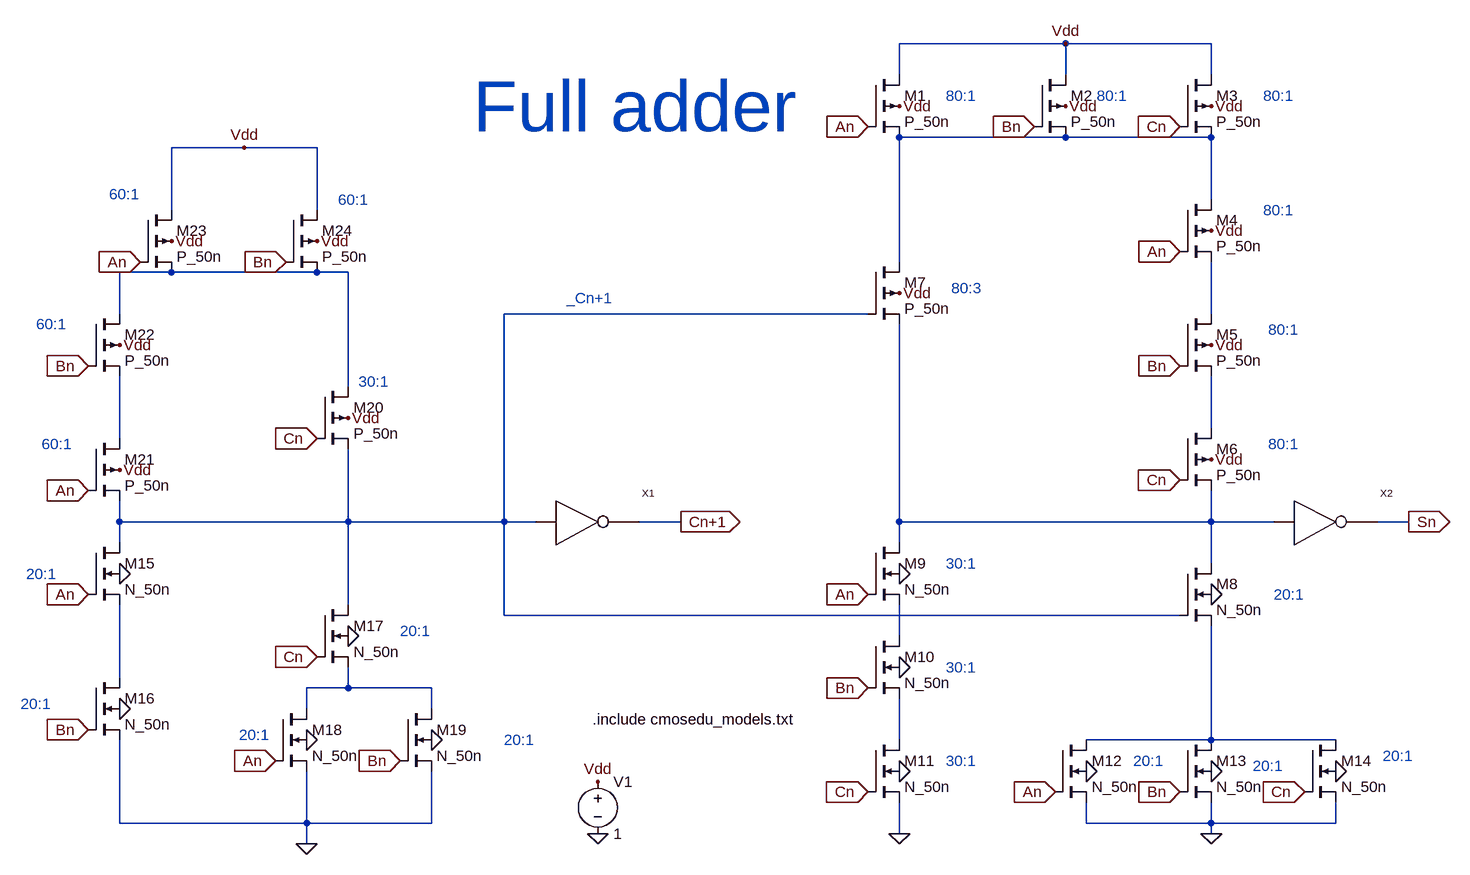
[diagram p0: schematic FullAdder.asc]
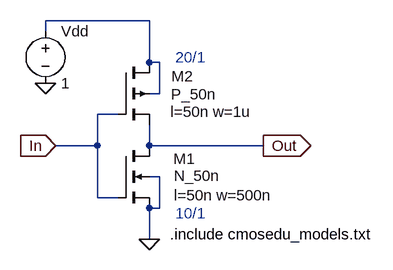
[diagram p1: sub-circuit inverter.asc]
FullAdder.asc, the LTspice schematic file:
Version 4
SHEET 1 1356 1268
WIRE 368 16 112 16
WIRE 592 16 368 16
WIRE 112 64 112 16
WIRE 368 64 368 16
WIRE 592 64 592 16
WIRE 368 160 112 160
WIRE 592 160 368 160
WIRE -896 176 -1008 176
WIRE -784 176 -896 176
WIRE 592 256 592 160
WIRE -1008 272 -1008 176
WIRE -784 272 -784 176
WIRE 112 352 112 160
WIRE -1008 368 -1088 368
WIRE -784 368 -1008 368
WIRE -736 368 -784 368
WIRE -1088 432 -1088 368
WIRE 64 432 -496 432
WIRE 592 432 592 352
WIRE -736 544 -736 368
WIRE 592 608 592 528
WIRE -1088 624 -1088 528
WIRE -1088 752 -1088 720
WIRE -736 752 -736 640
WIRE -736 752 -1088 752
WIRE -496 752 -496 432
WIRE -496 752 -736 752
WIRE -448 752 -496 752
WIRE -224 752 -288 752
WIRE 112 752 112 448
WIRE 592 752 592 704
WIRE 592 752 112 752
WIRE 688 752 592 752
WIRE 896 752 848 752
WIRE -1088 784 -1088 752
WIRE 112 784 112 752
WIRE 592 816 592 752
WIRE -736 880 -736 752
WIRE -496 896 -496 752
WIRE 544 896 -496 896
WIRE 112 928 112 880
WIRE -1088 992 -1088 880
WIRE -736 1008 -736 976
WIRE -736 1008 -800 1008
WIRE -608 1008 -736 1008
WIRE -800 1040 -800 1008
WIRE -608 1040 -608 1008
WIRE 112 1088 112 1024
WIRE 592 1088 592 912
WIRE 592 1088 400 1088
WIRE 784 1088 592 1088
WIRE -1088 1216 -1088 1088
WIRE -800 1216 -800 1136
WIRE -800 1216 -1088 1216
WIRE -608 1216 -608 1136
WIRE -608 1216 -800 1216
WIRE 400 1216 400 1184
WIRE 592 1216 592 1184
WIRE 592 1216 400 1216
WIRE 784 1216 784 1184
WIRE 784 1216 592 1216
WIRE 112 1232 112 1184
WIRE 592 1232 592 1216
WIRE -800 1248 -800 1216
FLAG 592 1232 0
FLAG 112 1232 0
FLAG -800 1248 0
FLAG -1056 352 An
IOPIN -1056 352 In
FLAG -1136 704 An
IOPIN -1136 704 In
FLAG -1136 864 An
IOPIN -1136 864 In
FLAG -848 1120 An
IOPIN -848 1120 In
FLAG 64 144 An
IOPIN 64 144 In
FLAG 544 336 An
IOPIN 544 336 In
FLAG 64 864 An
IOPIN 64 864 In
FLAG 352 1168 An
IOPIN 352 1168 In
FLAG -832 352 Bn
IOPIN -832 352 In
FLAG -1136 512 Bn
IOPIN -1136 512 In
FLAG -1136 1072 Bn
IOPIN -1136 1072 In
FLAG -656 1120 Bn
IOPIN -656 1120 In
FLAG 320 144 Bn
IOPIN 320 144 In
FLAG 544 512 Bn
IOPIN 544 512 In
FLAG 544 1168 Bn
IOPIN 544 1168 In
FLAG 64 1008 Bn
IOPIN 64 1008 In
FLAG -784 624 Cn
IOPIN -784 624 In
FLAG -784 960 Cn
IOPIN -784 960 In
FLAG 736 1168 Cn
IOPIN 736 1168 In
FLAG 64 1168 Cn
IOPIN 64 1168 In
FLAG 544 688 Cn
IOPIN 544 688 In
FLAG -224 752 Cn+1
IOPIN -224 752 Out
FLAG -352 1232 0
FLAG -352 1152 Vdd
FLAG 368 16 Vdd
FLAG -896 176 Vdd
FLAG 896 752 Sn
IOPIN 896 752 Out
FLAG -800 1088 0
FLAG -608 1088 0
FLAG -1088 1040 0
FLAG -736 928 0
FLAG -1088 832 0
FLAG 112 832 0
FLAG 112 976 0
FLAG 112 1136 0
FLAG 400 1136 0
FLAG 592 1136 0
FLAG 784 1136 0
FLAG 592 864 0
FLAG -1008 320 Vdd
FLAG -784 320 Vdd
FLAG -1088 480 Vdd
FLAG -736 592 Vdd
FLAG -1088 672 Vdd
FLAG 592 656 Vdd
FLAG 592 480 Vdd
FLAG 592 304 Vdd
FLAG 592 112 Vdd
FLAG 368 112 Vdd
FLAG 112 112 Vdd
FLAG 112 400 Vdd
FLAG 544 144 Cn
IOPIN 544 144 In
SYMBOL pmos4 64 64 R0
SYMATTR InstName M1
SYMATTR Value P_50n
SYMATTR Value2 l=50n w=4000n
SYMBOL pmos4 320 64 R0
SYMATTR InstName M2
SYMATTR Value P_50n
SYMATTR Value2 l=50n w=4000n
SYMBOL pmos4 544 64 R0
SYMATTR InstName M3
SYMATTR Value P_50n
SYMATTR Value2 l=50n w=4000n
SYMBOL pmos4 544 256 R0
SYMATTR InstName M4
SYMATTR Value P_50n
SYMATTR Value2 l=50n w=4000n
SYMBOL pmos4 544 432 R0
SYMATTR InstName M5
SYMATTR Value P_50n
SYMATTR Value2 l=50n w=4000n
SYMBOL pmos4 544 608 R0
SYMATTR InstName M6
SYMATTR Value P_50n
SYMATTR Value2 l=50n w=4000n
SYMBOL pmos4 64 352 R0
SYMATTR InstName M7
SYMATTR Value P_50n
SYMATTR Value2 l=50n w=1333.333n
SYMBOL nmos4 544 816 R0
SYMATTR InstName M8
SYMATTR Value N_50n
SYMATTR Value2 l=50n w=1000n
SYMBOL nmos4 64 784 R0
SYMATTR InstName M9
SYMATTR Value N_50n
SYMATTR Value2 l=50n w=1500n
SYMBOL nmos4 64 928 R0
SYMATTR InstName M10
SYMATTR Value N_50n
SYMATTR Value2 l=50n w=1500n
SYMBOL nmos4 64 1088 R0
SYMATTR InstName M11
SYMATTR Value N_50n
SYMATTR Value2 l=50n w=1500n
SYMBOL nmos4 352 1088 R0
SYMATTR InstName M12
SYMATTR Value N_50n
SYMATTR Value2 l=50n w=1000n
SYMBOL nmos4 544 1088 R0
SYMATTR InstName M13
SYMATTR Value N_50n
SYMATTR Value2 l=50n w=1000n
SYMBOL nmos4 736 1088 R0
SYMATTR InstName M14
SYMATTR Value N_50n
SYMATTR Value2 l=50n w=1000n
SYMBOL nmos4 -1136 784 R0
SYMATTR InstName M15
SYMATTR Value N_50n
SYMATTR Value2 l=50n w=1000n
SYMBOL nmos4 -1136 992 R0
SYMATTR InstName M16
SYMATTR Value N_50n
SYMATTR Value2 l=50n w=1000n
SYMBOL nmos4 -784 880 R0
SYMATTR InstName M17
SYMATTR Value N_50n
SYMATTR Value2 l=50n w=1000n
SYMBOL nmos4 -848 1040 R0
SYMATTR InstName M18
SYMATTR Value N_50n
SYMATTR Value2 l=50n w=1000n
SYMBOL nmos4 -656 1040 R0
SYMATTR InstName M19
SYMATTR Value N_50n
SYMATTR Value2 l=50n w=1000n
SYMBOL pmos4 -784 544 R0
SYMATTR InstName M20
SYMATTR Value P_50n
SYMATTR Value2 l=50n w=1500n
SYMBOL pmos4 -1136 624 R0
SYMATTR InstName M21
SYMATTR Value P_50n
SYMATTR Value2 l=50n w=3000n
SYMBOL pmos4 -1136 432 R0
SYMATTR InstName M22
SYMATTR Value P_50n
SYMATTR Value2 l=50n w=3000n
SYMBOL pmos4 -1056 272 R0
SYMATTR InstName M23
SYMATTR Value P_50n
SYMATTR Value2 l=50n w=3000n
SYMBOL pmos4 -832 272 R0
SYMATTR InstName M24
SYMATTR Value P_50n
SYMATTR Value2 l=50n w=3000n
SYMBOL voltage -352 1136 R0
SYMATTR InstName V1
SYMATTR Value 1
SYMBOL Inverter -416 688 R0
SYMATTR InstName X1
SYMBOL Inverter 720 688 R0
SYMATTR InstName X2
TEXT -360 1056 Left 2 !.include cmosedu_models.txt
TEXT -400 408 Left 2 ;_Cn+1
TEXT -752 256 Left 2 ;60:1
TEXT -1104 248 Left 2 ;60:1
TEXT -1216 448 Left 2 ;60:1
TEXT -1208 632 Left 2 ;60:1
TEXT -720 536 Left 2 ;30:1
TEXT -1232 832 Left 2 ;20:1
TEXT -1240 1032 Left 2 ;20:1
TEXT -656 920 Left 2 ;20:1
TEXT -496 1088 Left 2 ;20:1
TEXT -904 1080 Left 2 ;20:1
TEXT 688 864 Left 2 ;20:1
TEXT 856 1112 Left 2 ;20:1
TEXT 656 1128 Left 2 ;20:1
TEXT 472 1120 Left 2 ;20:1
TEXT 184 816 Left 2 ;30:1
TEXT 184 976 Left 2 ;30:1
TEXT 184 1120 Left 2 ;30:1
TEXT 192 392 Left 2 ;80:3
TEXT 680 632 Left 2 ;80:1
TEXT 680 456 Left 2 ;80:1
TEXT 672 272 Left 2 ;80:1
TEXT 672 96 Left 2 ;80:1
TEXT 416 96 Left 2 ;80:1
TEXT 184 96 Left 2 ;80:1
TEXT -544 112 Left 7 ;Full adder

inverter.asc, the sub-circuit schematic file:
Version 4
SHEET 1 1136 680
WIRE 448 -368 288 -368
WIRE 288 -352 288 -368
WIRE 448 -304 448 -368
WIRE 464 -304 448 -304
WIRE 464 -256 464 -304
WIRE 464 -256 448 -256
WIRE 400 -224 368 -224
WIRE 368 -176 368 -224
WIRE 368 -176 304 -176
WIRE 448 -176 448 -208
WIRE 624 -176 448 -176
WIRE 464 -128 448 -128
WIRE 368 -96 368 -176
WIRE 400 -96 368 -96
WIRE 464 -80 464 -128
WIRE 464 -80 448 -80
WIRE 448 -32 448 -80
FLAG 304 -176 In
IOPIN 304 -176 In
FLAG 624 -176 Out
IOPIN 624 -176 Out
FLAG 448 -32 0
FLAG 288 -272 0
SYMBOL nmos4 400 -176 R0
WINDOW 0 119 20 Right 2
WINDOW 3 157 46 Right 2
WINDOW 123 238 76 Right 2
SYMATTR InstName M1
SYMATTR Value N_50n
SYMATTR Value2 l=50n w=500n
SYMBOL pmos4 400 -304 R0
WINDOW 0 116 21 Right 2
WINDOW 3 151 49 Right 2
WINDOW 123 206 76 Right 2
SYMATTR InstName M2
SYMATTR Value P_50n
SYMATTR Value2 l=50n w=1u
SYMBOL voltage 288 -368 R0
SYMATTR InstName Vdd
SYMATTR Value 1
TEXT 488 -312 Left 2 ;20/1
TEXT 488 -72 Left 2 ;10/1
TEXT 480 -40 Left 2 !.include cmosedu_models.txt

The netlist it stands for:
* FullAdder.asc
M1 Vdd An N001 Vdd P_50n l=50n w=4000n
M2 Vdd Bn N001 Vdd P_50n l=50n w=4000n
M3 Vdd Cn N001 Vdd P_50n l=50n w=4000n
M4 N001 An N004 Vdd P_50n l=50n w=4000n
M5 N004 Bn N005 Vdd P_50n l=50n w=4000n
M6 N005 Cn N007 Vdd P_50n l=50n w=4000n
M7 N001 N003 N007 Vdd P_50n l=50n w=1333.333n
M8 N007 N003 N012 0 N_50n l=50n w=1000n
M9 N007 An N008 0 N_50n l=50n w=1500n
M10 N008 Bn N011 0 N_50n l=50n w=1500n
M11 N011 Cn 0 0 N_50n l=50n w=1500n
M12 N012 An 0 0 N_50n l=50n w=1000n
M13 N012 Bn 0 0 N_50n l=50n w=1000n
M14 N012 Cn 0 0 N_50n l=50n w=1000n
M15 N003 An N009 0 N_50n l=50n w=1000n
M16 N009 Bn 0 0 N_50n l=50n w=1000n
M17 N003 Cn N010 0 N_50n l=50n w=1000n
M18 N010 An 0 0 N_50n l=50n w=1000n
M19 N010 Bn 0 0 N_50n l=50n w=1000n
M20 N002 Cn N003 Vdd P_50n l=50n w=1500n
M21 N006 An N003 Vdd P_50n l=50n w=3000n
M22 N002 Bn N006 Vdd P_50n l=50n w=3000n
M23 Vdd An N002 Vdd P_50n l=50n w=3000n
M24 Vdd Bn N002 Vdd P_50n l=50n w=3000n
V1 Vdd 0 1
XX1 N003 Cn+1 inverter
XX2 N007 Sn inverter

* block symbol definitions
.subckt inverter In Out
M1 Out In 0 0 N_50n l=50n w=500n
M2 N001 In Out N001 P_50n l=50n w=1u
Vdd N001 0 1
* 20/1
* 10/1
.include cmosedu_models.txt
.ends inverter

.model NMOS NMOS
.model PMOS PMOS
.lib standard.mos
.include cmosedu_models.txt
* _Cn+1
* 60:1
* 60:1
* 60:1
* 60:1
* 30:1
* 20:1
* 20:1
* 20:1
* 20:1
* 20:1
* 20:1
* 20:1
* 20:1
* 20:1
* 30:1
* 30:1
* 30:1
* 80:3
* 80:1
* 80:1
* 80:1
* 80:1
* 80:1
* 80:1
* Full adder
.backanno
.end